# EAGLE design low-voltage-detector (EAGLE 9.5.0)
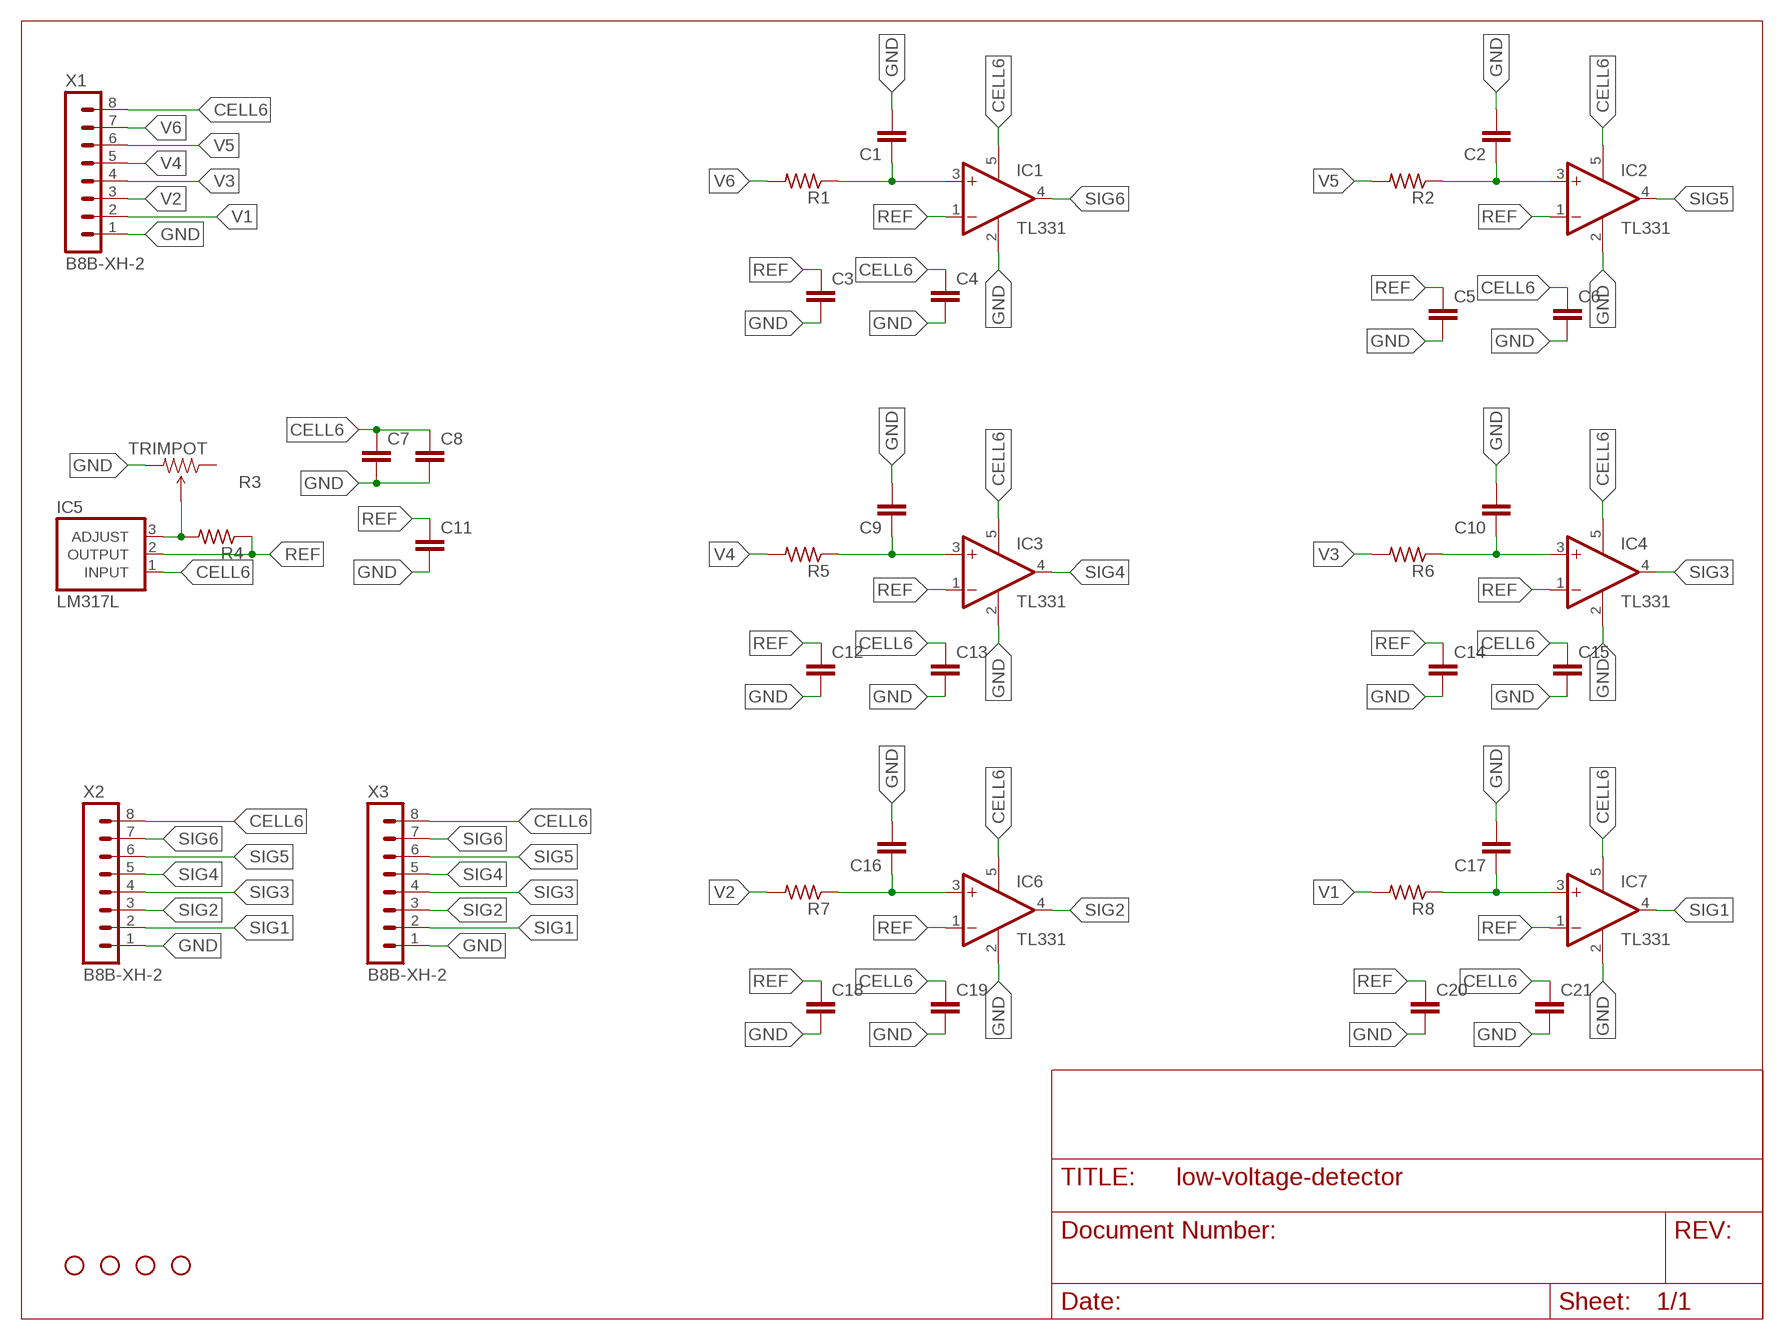
[diagram p0: schematic, sheet 1]

## Parts
C1  CAPACITOR_0805  [0805]
C2  CAPACITOR_0805  [0805]
C3  CAPACITOR_0805  [0805]
C4  CAPACITOR_0805  [0805]
C5  CAPACITOR_0805  [0805]
C6  CAPACITOR_0805  [0805]
C7  CAPACITOR_0805  [0805]
C8  CAPACITOR_0805  [0805]
C9  CAPACITOR_0805  [0805]
C10  CAPACITOR_0805  [0805]
C11  CAPACITOR_0805  [0805]
C12  CAPACITOR_0805  [0805]
C13  CAPACITOR_0805  [0805]
C14  CAPACITOR_0805  [0805]
C15  CAPACITOR_0805  [0805]
C16  CAPACITOR_0805  [0805]
C17  CAPACITOR_0805  [0805]
C18  CAPACITOR_0805  [0805]
C19  CAPACITOR_0805  [0805]
C20  CAPACITOR_0805  [0805]
C21  CAPACITOR_0805  [0805]
H1  STAND-OFF  [STAND-OFF]
H2  STAND-OFF  [STAND-OFF]
H3  STAND-OFF  [STAND-OFF]
H4  STAND-OFF  [STAND-OFF]
IC1  TL331  [DBV-R-PDSO-G5]
IC2  TL331  [DBV-R-PDSO-G5]
IC3  TL331  [DBV-R-PDSO-G5]
IC4  TL331  [DBV-R-PDSO-G5]
IC5  LM317L  LINEAR-REGULATOR_LM317L  [TO92]
IC6  TL331  [DBV-R-PDSO-G5]
IC7  TL331  [DBV-R-PDSO-G5]
R1  R-US_R0805  [R0805]
R2  R-US_R0805  [R0805]
R3  TRIMPOT  [490-2877-ND]
R4  R-US_R0805  [R0805]
R5  R-US_R0805  [R0805]
R6  R-US_R0805  [R0805]
R7  R-US_R0805  [R0805]
R8  R-US_R0805  [R0805]
X1  B8B-XH-2  [B8B-XH-A]
X2  B8B-XH-2  [B8B-XH-A]
X3  B8B-XH-2  [B8B-XH-A]

## Nets
CELL6: C4.1 C6.1 C7.1 C8.1 C13.1 C15.1 C19.1 C21.1 IC1.5(V+) IC2.5(V+) IC3.5(V+) IC4.5(V+) IC5.1(INPUT) IC6.5(V+) IC7.5(V+) X1.8 X2.8 X3.8
GND: C1.2 C2.2 C3.2 C4.2 C5.2 C6.2 C7.2 C8.2 C9.2 C10.2 C11.2 C12.2 C13.2 C14.2 C15.2 C16.2 C17.2 C18.2 C19.2 C20.2 C21.2 IC1.2(GND) IC2.2(GND) IC3.2(GND) IC4.2(GND) IC6.2(GND) IC7.2(GND) R3.P$3(CW) X1.1 X2.1 X3.1
N$1: C1.1 IC1.3(+IN) R1.1
N$2: C2.1 IC2.3(+IN) R2.1
N$3: C9.1 IC3.3(+IN) R5.1
N$4: C10.1 IC4.3(+IN) R6.1
N$5: C16.1 IC6.3(+IN) R7.1
N$6: C17.1 IC7.3(+IN) R8.1
N$18: IC5.3(ADJUST) R3.P$2(WIPER) R4.2
REF: C3.1 C5.1 C11.1 C12.1 C14.1 C18.1 C20.1 IC1.1(-IN) IC2.1(-IN) IC3.1(-IN) IC4.1(-IN) IC5.2(OUTPUT) IC6.1(-IN) IC7.1(-IN) R4.1
SIG1: IC7.4(OUT) X2.2 X3.2
SIG2: IC6.4(OUT) X2.3 X3.3
SIG3: IC4.4(OUT) X2.4 X3.4
SIG4: IC3.4(OUT) X2.5 X3.5
SIG5: IC2.4(OUT) X2.6 X3.6
SIG6: IC1.4(OUT) X2.7 X3.7
V1: R8.2 X1.2
V2: R7.2 X1.3
V3: R6.2 X1.4
V4: R5.2 X1.5
V5: R2.2 X1.6
V6: R1.2 X1.7
Unconnected: R3.P$1(CCW)

## Library data of the parts
C1-C21 = EcoCar-Passives:CAPACITOR_0805
H1-H4 = EcoCar-Miscellaneous:STAND-OFF: Stand Off Drill holes for mechanically mounting via screws, standoffs, etc. Note: Use the keepout ring to avoid running the screw head into surrounding components. Variant Overviews STAND-OFF - Mechanical footprint for a #4 phillips button head screw. STAND-OFF-TIGHT - Mechanical footprint for a #4 phillips button head screw, Example SparkFun Products Screw - Phillips Head (1/4", 4-40, 10 pack) <https://www.sparkfun.com/products/10453> (PRT-10453) Screw - Phillips Head (1/2", 4-40, 10 pack) <https://www.sparkfun.com/products/10452> (PRT-10452) Screw - Phillips Head (3/4", 4-40, 10 pack) <https://www.sparkfun.com/products/10451> (PRT-10451) Screw - Phillips Head (1", 4-40, 10 pack) <https://www.sparkfun.com/products/10450> (PRT-10450)
IC1-IC4 IC6 IC7 = linear:TL331: SINGLE DIFFERENTIAL COMPARATOR Source: Data sheet <http://www.ti.com/lit/ds/symlink/tl331-q1.pdf>
IC5 = EcoCar-Integrated-Circuits:LINEAR-REGULATOR_LM317L: Adjustable Positive Linear Voltage Regulator Manufacturer: Texas Instruments Part Number: LM317LILPR Digikey Part Number: 296-20679-1-ND
R1 R2 R4-R8 = rcl:R-US_: RESISTOR, American symbol; SPICEPREFIX: R
R3 = trimpot:TRIMPOT
X1-X3 = con-JST:B8B-XH: JST XH series header 2.50mm pitch disconnectable crimp style connectors, vertical (side entry type), 8 pins

## Board
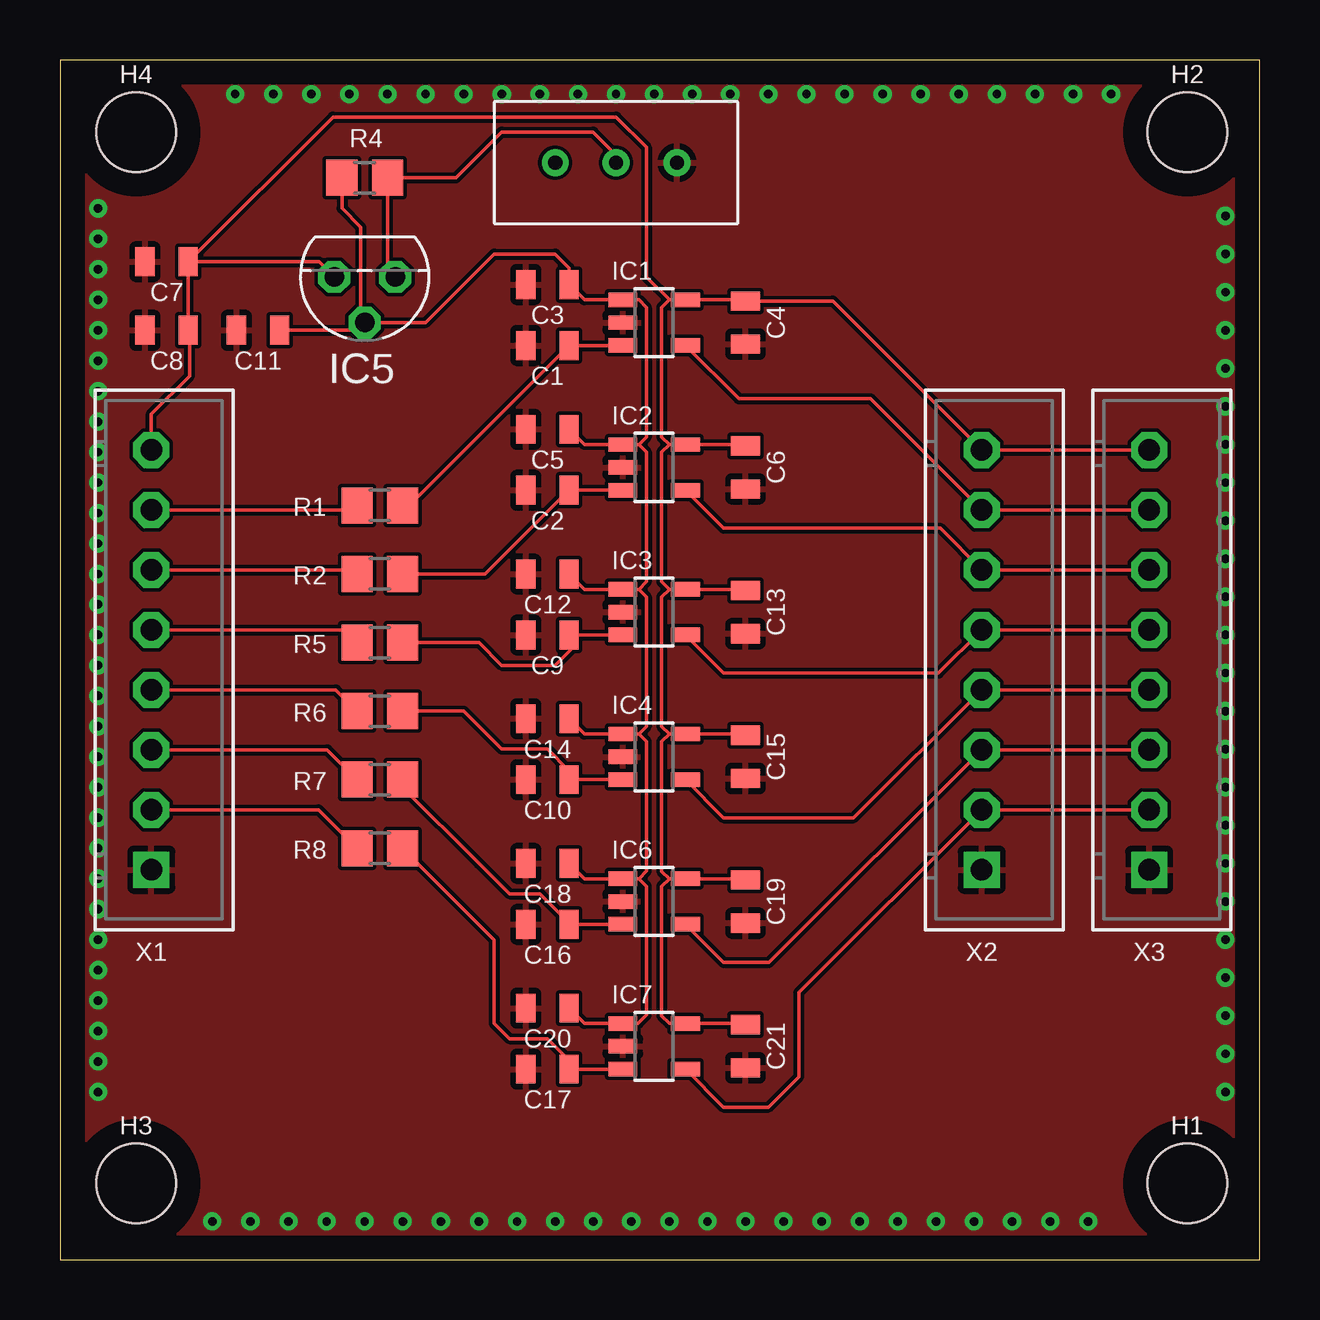
[diagram p1: board, top side]
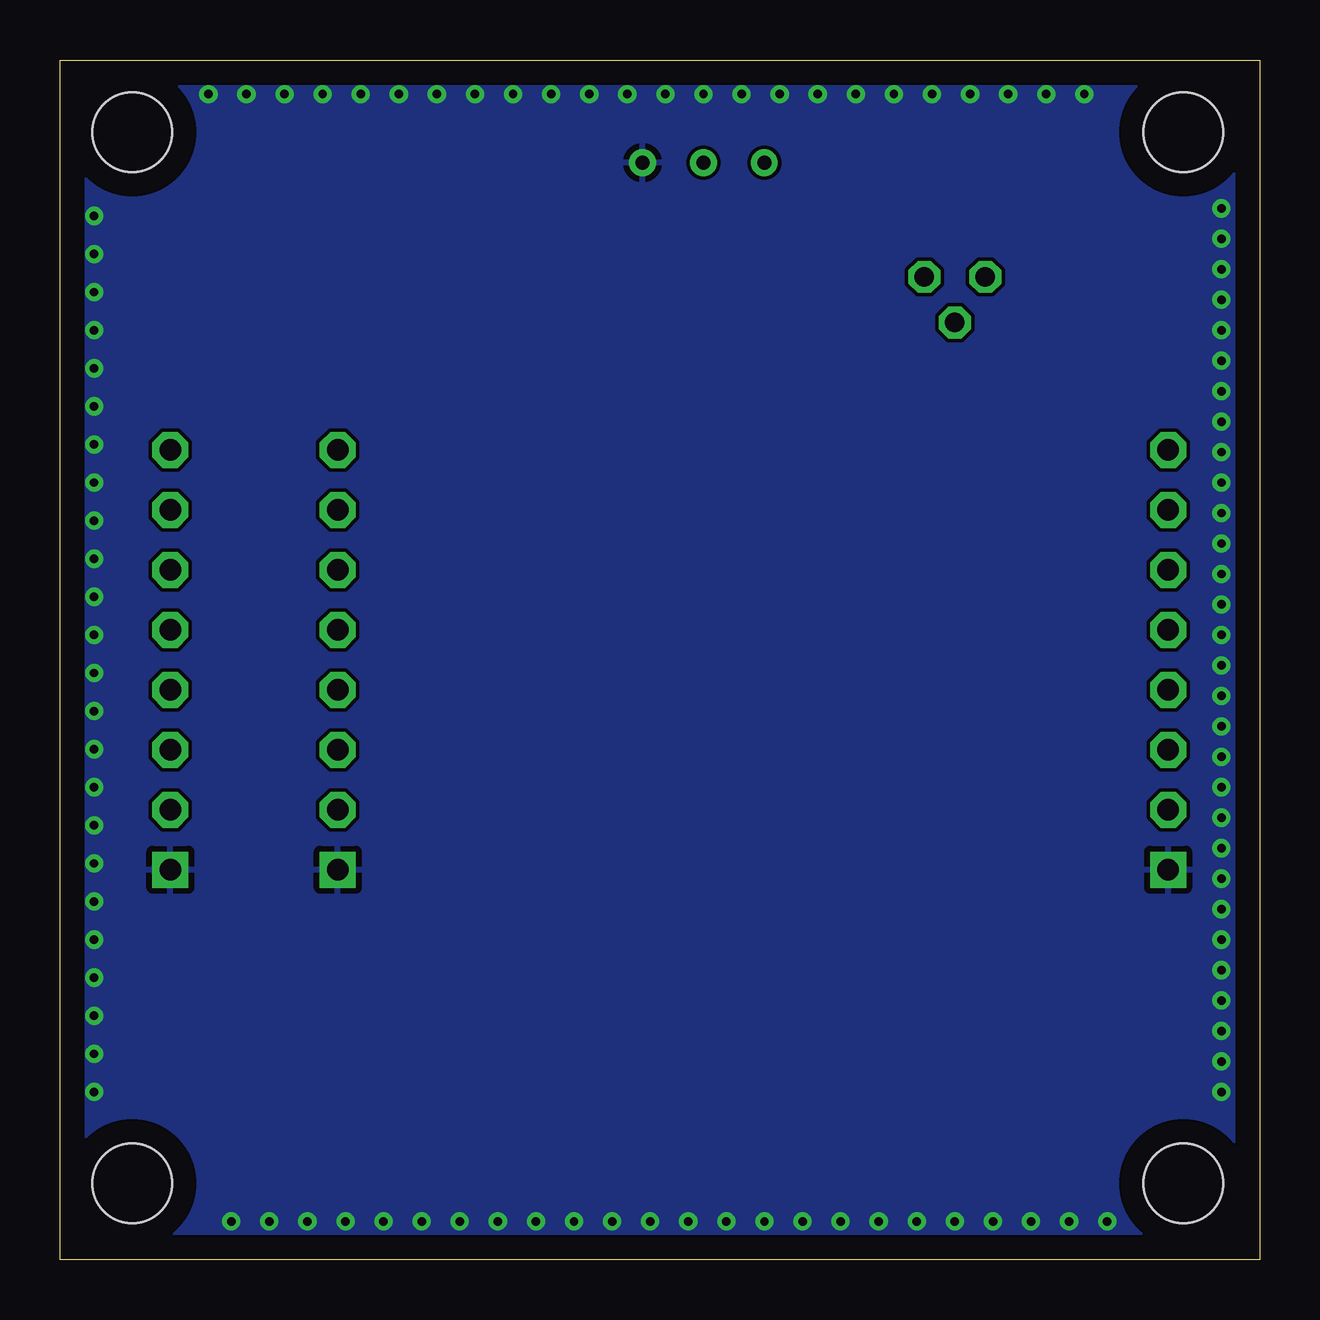
[diagram p2: board, bottom side, seen from below]

Size 50 x 50 mm. Coordinates in mm from the lower left corner, seen from the top.
Outline: 0,0 50,0 50,50 0,50 0,0
Copper layers (1*16): Top 0.035mm / dielectric 1.5mm / Bottom 0.035mm
Design rules "default": minimum track width 6mil, minimum drill 0.35mm, track to track 6mil, track to pad 6mil, pad to pad 6mil, via to via 6mil, smd to smd 6mil, copper to edge 40mil, drill to drill 6mil, minimum pad ring 10mil, minimum via ring 8mil, stop-mask expansion 4mil, vias tented up to drill 0mil, thermal gap 10mil

### Footprints (pad centres in the part's own frame; a part is rotated, then mirrored left to right if it is on the bottom)
0805 = smd 0.8 x 1.2: 1 -0.9,0; 2 0.9,0
STAND-OFF = hole 3.302: 0,0
DBV-R-PDSO-G5 = smd 0.6 x 1.2: 1 -0.95,-1.306; 2 0,-1.306; 3 0.95,-1.306; 4 0.95,1.306; 5 -0.95,1.306
TO92 = drill 0.813 octagon: 1 1.27,0; 2 0,1.905; 3 -1.27,0
R0805 = smd 1.3 x 1.5: 1 -0.95,0; 2 0.95,0
490-2877-ND = drill 0.6: P$1 0,-2.54; P$2 0,0; P$3 0,2.54
B8B-XH-A = drill 0.9 pad 1.5 square: 1 8.75,0 | drill 0.9 pad 1.5 octagon: 2 6.25,0; 3 3.75,0; 4 1.25,0; 5 -1.25,0; 6 -3.75,0; 7 -6.25,0; 8 -8.75,0

### Placement (x,y rotation side)
C1  20.32,38.1 180 top
C2  20.32,32.07 180 top
C3  20.32,40.64 180 top
C4  28.57,39.05 270 top
C5  20.32,34.61 180 top
C6  28.57,33.02 270 top
C7  4.45,41.59 180 top
C8  4.45,38.73 180 top
C9  20.32,26.04 180 top
C10  20.32,20 180 top
C11  8.26,38.73 180 top
C12  20.32,28.57 180 top
C13  28.57,26.99 270 top
C14  20.32,22.54 180 top
C15  28.57,20.95 270 top
C16  20.32,13.97 180 top
C17  20.32,7.94 180 top
C18  20.32,16.51 180 top
C19  28.57,14.92 270 top
C20  20.32,10.48 180 top
C21  28.57,8.89 270 top
H1  46.99,3.17 0 top
H2  46.99,46.99 0 top
H3  3.17,3.17 0 top
H4  3.17,46.99 0 top
IC1  24.77,39.05 270 top
IC2  24.77,33.02 270 top
IC3  24.77,26.99 270 top
IC4  24.77,20.95 270 top
IC5  12.7,40.96 180 top
IC6  24.77,14.92 270 top
IC7  24.77,8.89 270 top
R1  13.34,31.43 180 top
R2  13.34,28.57 180 top
R3  23.18,45.72 270 top
R4  12.7,45.09 0 top
R5  13.34,25.72 180 top
R6  13.34,22.86 180 top
R7  13.34,20 180 top
R8  13.34,17.14 180 top
X1  3.81,25 270 top
X2  38.42,25 270 top
X3  45.4,25 270 top

### Tracks (layer width: path | path; a pad name or v marks a point on that pad's centre or on a via)
CELL6
  Top 0.152: X1.8 3.81,35.24 5.4,36.83 5.4,38.68 C8.1 C7.1 | C7.1 10.79,41.59 IC5.1 | C6.1 28.52,33.97 IC2.5 25.4,33.97 | C13.1 28.52,27.94 IC3.5 25.4,27.94 | C15.1 28.52,21.91 IC4.5 25.4,21.91 | C19.1 28.52,15.87 IC6.5 25.4,15.87 | C21.1 28.52,9.84 IC7.5 25.4,9.84 25.08,10.16 25.08,15.56 25.4,15.87 | 25.4,40 IC1.5 28.52,40 C4.1 32.22,39.95 X2.8 X3.8 | 25.4,40 25.08,39.69 25.08,34.28 25.4,33.97 | 25.4,15.87 25.08,16.19 25.08,21.59 25.4,21.91 | 25.4,21.91 25.08,22.22 25.08,27.62 25.4,27.94 | 25.4,27.94 25.08,28.26 25.08,33.66 25.4,33.97 | C7.1 11.38,47.62 23.18,47.62 24.45,46.35 24.45,40.95 25.4,40
GND  (via drill 0.35)
  other vias: 6.35,1.59 7.94,1.59 9.53,1.59 11.11,1.59 12.7,1.59 14.29,1.59 15.88,1.59 17.46,1.59 19.05,1.59 20.64,1.59 22.23,1.59 23.81,1.59 25.4,1.59 26.99,1.59 28.57,1.59 30.16,1.59 31.75,1.59 33.34,1.59 34.92,1.59 36.51,1.59 38.1,1.59 39.69,1.59 41.27,1.59 42.86,1.59 48.58,6.99 48.58,8.57 48.58,10.16 48.58,11.75 48.58,13.34 48.58,14.92 48.58,16.51 48.58,18.1 48.58,19.68 48.58,21.27 48.58,22.86 48.58,24.45 48.58,26.04 48.58,27.62 48.58,29.21 48.58,30.8 48.58,32.38 48.58,33.97 48.58,35.56 48.58,37.15 48.58,38.73 48.58,40.32 48.58,41.91 48.58,43.5 43.81,48.58 42.23,48.58 40.64,48.58 39.05,48.58 37.47,48.58 35.88,48.58 34.29,48.58 32.7,48.58 31.11,48.58 29.53,48.58 27.94,48.58 26.35,48.58 24.77,48.58 23.18,48.58 21.59,48.58 20,48.58 18.41,48.58 16.83,48.58 15.24,48.58 13.65,48.58 12.06,48.58 10.48,48.58 8.89,48.58 7.3,48.58 1.59,43.81 1.59,42.55 1.59,41.27 1.59,40.01 1.59,38.73 1.59,37.47 1.59,36.2 1.59,34.92 1.59,33.66 1.59,32.38 1.59,31.11 1.59,29.84 1.59,28.57 1.59,27.3 1.59,26.04 1.59,24.77 1.59,23.5 1.59,22.23 1.59,20.95 1.59,19.68 1.59,18.41 1.59,17.14 1.59,15.88 1.59,14.61 1.59,13.34 1.59,12.06 1.59,10.79 1.59,9.53 1.59,8.26 1.59,6.99
  pour Top: -5.71,55.88 54.61,55.88 54.61,-3.81 -5.71,-3.81
  pour Bottom: -1.27,52.07 52.7,52.07 52.7,7.62 52.7,-2.54 47.94,-2.54 -1.27,-2.54
N$1
  Top 0.152: IC1.3 C1.1 14.55,31.43 R1.1
N$2
  Top 0.152: IC2.3 C2.1 17.73,28.57 R2.1
N$3
  Top 0.152: C9.1 21.27,26.04 | 21.27,26.04 IC3.3 | R5.1 17.46,25.72 18.41,24.77 20.64,24.77 21.27,25.4 21.27,26.04
N$4
  Top 0.152: IC4.3 C10.1 21.22,20.37 20.32,21.27 18.41,21.27 16.83,22.86 R6.1
N$5
  Top 0.152: C16.1 21.27,13.97 | 21.27,13.97 IC6.3 | R7.1 14.29,19.68 17.46,16.51 18.73,15.24 20,15.24 21.27,13.97
N$6
  Top 0.152: IC7.3 C17.1 21.22,8.31 20.32,9.21 18.73,9.21 18.1,9.84 18.1,13.33 R8.1
N$18
  Top 0.152: IC5.3 13.65,41.28 R4.2 16.51,45.09 18.41,46.99 22.23,46.99 23.18,46.04 R3.P$2
REF
  Top 0.152: C11.1 12.38,38.73 12.54,38.89 | 12.54,38.89 IC5.2 15.24,39.05 18.1,41.91 20.64,41.91 21.22,41.33 C3.1 21.86,40 IC1.1 24.13,40 24.45,39.69 24.45,34.29 24.13,33.97 | R4.1 11.75,43.81 12.54,43.02 12.54,38.89 | 24.13,15.88 24.45,15.56 24.45,10.19 24.09,9.84 IC7.1 21.86,9.84 C20.1 | 24.13,15.88 IC6.1 21.86,15.87 C18.1 | 24.13,21.91 24.45,21.59 24.45,16.19 24.13,15.88 | 24.13,21.91 IC4.1 21.86,21.91 C14.1 | 24.13,21.91 24.45,22.23 24.45,27.62 24.44,27.62 24.13,27.94 | 24.13,27.94 IC3.1 21.86,27.94 C12.1 | 24.13,27.94 24.45,28.26 24.45,33.66 24.13,33.97 | 24.13,33.97 IC2.1 21.86,33.97 C5.1
SIG1
  Top 0.152: IC7.4 27.66,6.35 29.53,6.35 30.8,7.62 30.8,11.13 X2.2 X3.2
SIG2
  Top 0.152: IC6.4 27.66,12.38 29.55,12.38 X2.3 X3.3
SIG3
  Top 0.152: IC4.4 27.66,18.41 33.08,18.41 X2.4 X3.4
SIG4
  Top 0.152: IC3.4 27.66,24.45 36.62,24.45 X2.5 X3.5
SIG5
  Top 0.152: IC2.4 27.66,30.48 36.69,30.48 X2.6 X3.6
SIG6
  Top 0.152: IC1.4 28.3,35.88 33.79,35.88 X2.7 X3.7
V1
  Top 0.152: X1.2 10.78,18.75 R8.2
V2
  Top 0.152: X1.3 11.14,21.25 R7.2
V3
  Top 0.152: X1.4 11.49,23.75 R6.2
V4
  Top 0.152: X1.5 11.85,26.25 R5.2
V5
  Top 0.152: X1.6 12.21,28.75 R2.2
V6
  Top 0.152: X1.7 12.2,31.25 R1.2